# Altium schematic sheet charging sdc.SchDoc
size A; SheetNumber: 1; SheetTotal: 1
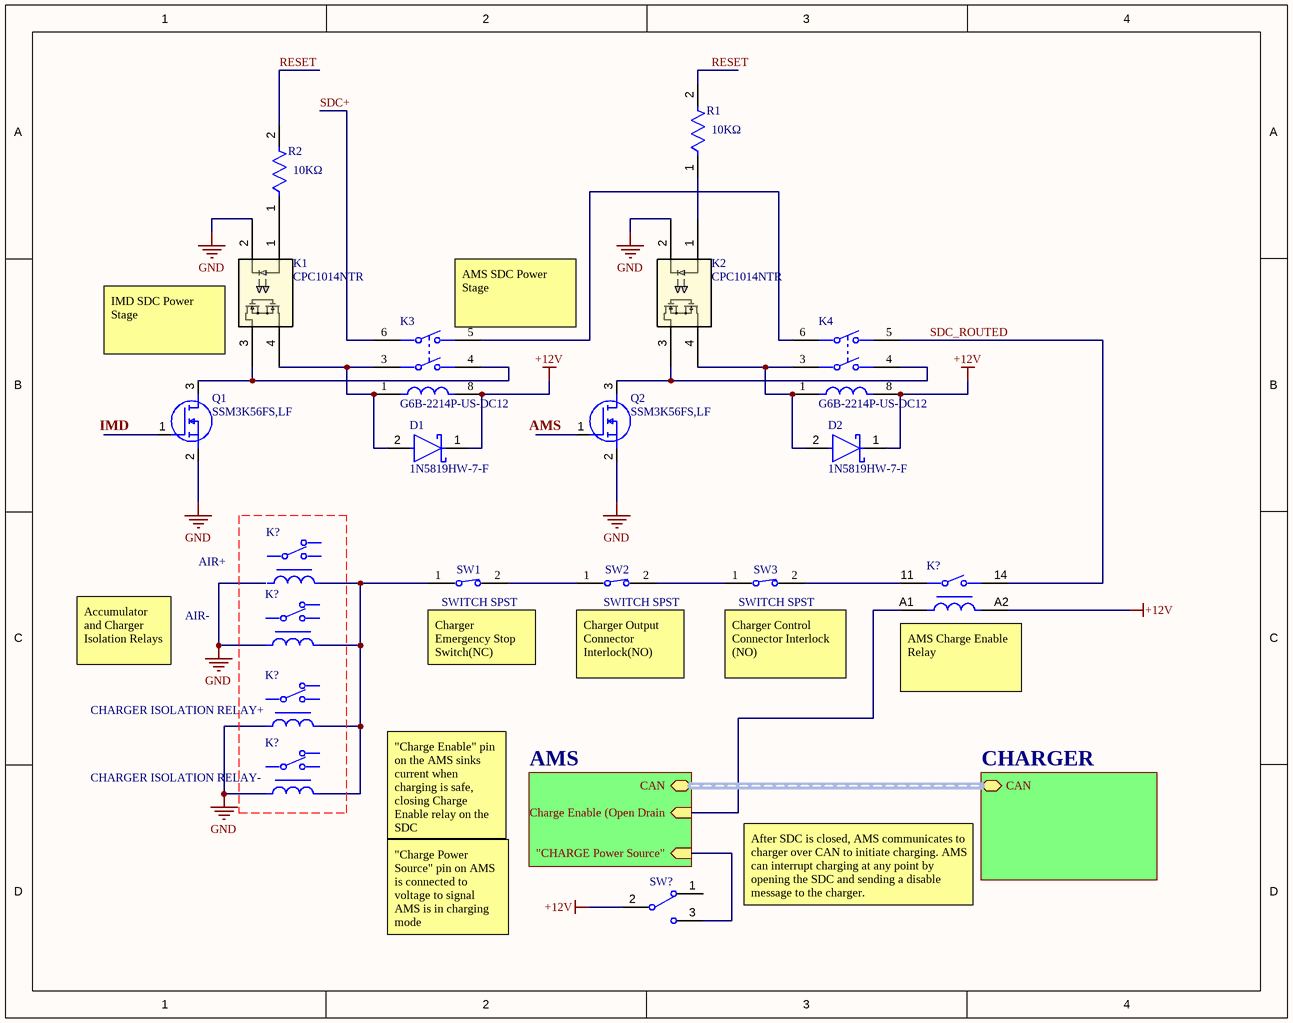
[diagram p0: charging sdc.SchDoc]

## Parts
(Parts that share a designator on the sheet are numbered #1, #2 ... from top to bottom, then left to right.)
D1  1N5819HW-7-F  [FP-SOD123-IPC_A]
D2  1N5819HW-7-F  [FP-SOD123-IPC_A]
K1  CPC1014NTR  [CPC1014N_IXY]
K2  CPC1014NTR  [CPC1014N_IXY]
K3  G6B-2214P-US-DC12  [FP-G6B-2214P-US-DC24-MFG]
K4  G6B-2214P-US-DC12  [FP-G6B-2214P-US-DC24-MFG]
K?#1  AIR+  [FP-T9AP5D52-12-MFG]
K?#2  1-1415899-6  [FP-1-1415899-6-MFG]  (value not drawn)
K?#3  AIR-  [FP-T9AP5D52-12-MFG]
K?#4  CHARGER ISOLATION RELAY+  [FP-T9AP5D52-12-MFG]
K?#5  CHARGER ISOLATION RELAY-  [FP-T9AP5D52-12-MFG]
Q1  SSM3K56FS,LF  [1SS423]
Q2  SSM3K56FS,LF  [1SS423]
R1  Resistance: 10KΩ  [FP-RP73P-2A-MFG]  (hidden comment: RP73PF2A10KBTDF)
R2  Resistance: 10KΩ  [FP-RP73P-2A-MFG]  (hidden comment: RP73PF2A10KBTDF)
SW1  SWITCH SPST  [FP-D3SH-B1L-MFG]
SW2  SWITCH SPST  [FP-D3SH-B1L-MFG]
SW3  SWITCH SPST  [FP-D3SH-B1L-MFG]
SW?  EG1218  [ESWI-EG1218_V]  (value not drawn)

## Sub-sheets
AMS = File Name: CAN (bidir), "CHARGE Power Source" (in), Charge Enable (Open Drain (in)
CHARGER = File Name: CAN (bidir)

## Nets
+12V: D1.1(C) D2.1(C) K3.8 K4.8 K?#2.A2 SW?.2(COM)
GND: K1.2 K2.2 Q1.2(S) Q2.2(S)
AMS: Q2.1(G)
IMD: Q1.1(G)
RESET: R1.2 R2.2
SDC+: K3.6
SDC_ROUTED: K4.5 K?#2.14
NetD1_2: D1.2(A) K1.4 K3.1 K3.3
NetD2_2: D2.2(A) K2.4 K4.1 K4.3
NetK1_1: K1.1 R2.1
NetK1_3: K1.3 K3.4 Q1.3(D)
NetK2_1: K2.1 R1.1
NetK2_3: K2.3 K4.4 Q2.3(D)
NetK3_5: K3.5 K4.6
NetK?#2_11: K?#2.11 SW3.2(NC)
NetK?#2_A1: K?#2.A1 ; sheet AMS/Charge Enable (Open Drain
NetSW1_2: SW1.2(NC) SW2.1(COM)
NetSW2_2: SW2.2(NC) SW3.1(COM)
NetSW?_3: SW?.3 ; sheet AMS/"CHARGE Power Source"

Not connected (* = marked no-connect by the designer): SW1 1(COM); SW? 1

## Buses and harness runs
harness sheet AMS/CAN = sheet CHARGER/CAN

## Notes on the sheet
- IMD SDC Power Stage
- (near K3) AMS SDC Power Stage
- Accumulator and Charger Isolation Relays
- (near SW1) Charger Emergency Stop Switch(NC)
- (near SW2) Charger Output Connector Interlock(NO)
- (near SW3) Charger Control Connector Interlock (NO)
- (near K?#2) AMS Charge Enable Relay
- "Charge Enable" pin on the AMS sinks current when charging is safe, closing Charge Enable relay on the SDC
- After SDC is closed, AMS communicates to charger over CAN to initiate charging. AMS can interrupt charging at any point by opening the SDC and sending a disable message to the charger.
- "Charge Power Source" pin on AMS is connected to voltage to signal AMS is in charging mode
- DWG. NO.
- REV.
- SHT.
- REVISION
- DESCRIPTION
- DATE
- APPROVED
- THIS DOCUMENT AND THE DATA DISCLOSED HEREIN OR HEREWITH IS THE PROPERTY OF ALTIUM LIMITED AND MAY BE FREELY DISTRIBUTED IN WHOLE. NO RIGHTS ARE RESERVED OR EXPRESS OR IMPLIED WARANTEE GIVEN.
- ENG:
- DSN:
- APPROVALS
- PROJECT
- DOCUMENT REVISION:
- DESIGN ITEM:
- CHK:
- BOM:
- REFERENCE DOCUMENTS
- PROJECT REVISION:
- TITLE
- FAB DWG:
- PCB DWG:
- ASSY DWG:
- SCALE:
- SIZE
- C
- CAGE CODE
- FILE NAME
- DWG NO.
- SHEET
- OF
- REV

## Library data of the parts
D1 D2 = CMP-0303-00003-3: DIODE SCHOTTKY 40V 1A SOD123; Forward Voltage: 450mV; Capacitance: 110pF; Max Forward Surge Current (Ifsm): 25A; Peak Reverse Current: 50uA; Polarity: Standard; Element Configuration: Single; Max Power Dissipation: 450mW; Min Operating Temperature: -65°C; Package Quantity: 3000; Contact Plating: Tin; Weight: 0.000353oz; Max Repetitive Reverse Voltage (Vrrm): 40V; Max Reverse Voltage (DC): 40V; Height: 1.25mm; Average Rectified Current: 1A; Width: 1.7mm; Case/Package: SOD-123-2; Lead Free: Lead Free; Max Operating Temperature: 125°C; Current Rating: 1A; Termination: SMD/SMT; Forward Current: 1A; Radiation Hardening: No; Number of Pins: 2; Length: 2.85mm; Voltage Rating (DC): 40V; REACH SVHC: No SVHC; Peak Non-Repetitive Surge Current: 25A; Packaging: Tape and Reel; Output Current: 1A
K1 K2 = CPC1014NTR: No Description Available; Mfr_Name: Littelfuse Inc; Copyright: Copyright (C) 2022 Ultra Librarian. All rights reserved.; Manufacturer_Part_Number: CPC1014NTR; Digi-Key_Part_Number_1: CLA314TR-ND; Digi-Key_Part_Number_2: CLA314CT-ND; Digi-Key_Part_Number_3: CLA314DKR-ND; RefDes: RefDes; Type: DEV
K3 K4 = CMP-08822-000243-1: RELAY GEN PURPOSE DPST 5A 24V; Voltage Rating (DC): 125V; Release Time: 10ms; Relay Type: General Purpose; Coil Current: 8.3mA; Coil Power: 300mW; Max Voltage Rating (AC): 380V; Approvals: UL; Power Consumption: 200mW; Coil Type: Non-Latching; Coil Resistance: 2.88kR; Number of Pins: 6; Width: 10mm; Radiation Hardening: No; Contact Current Rating: 5A; Length: 20mm; Min Operating Temperature: -25°C; Operate Time: 10ms; Max Voltage Rating (DC): 125V; Depth: 11mm; Packaging: Bulk; Lead Free: Lead Free; Contact Material: Silver; Case/Package: DIP; Throw Configuration: DPST; Mount: Through Hole; Max Operating Temperature: 70°C; Coil Voltage (DC): 24V; Max Current Rating: 5A; Height: 10mm; Package Quantity: 100; Weight: 0.141096oz; Voltage Rating (AC): 380V; Current Rating: 5A; Series: G6B; Termination: PC Pin
K?#1 K?#3-K?#5 = CMP-03395-000322-1: RELAY GEN PURPOSE SPDT 20A 12V; Coil Resistance: 144R; Contact Voltage Rating (AC): 277V; Release Time: 15ms; Coil Power: 1W; Coil Current: 83mA; Approvals: UL; Max Voltage Rating (DC): 28V; Current Rating: 30A; Relay Type: General Purpose; Coil Type: Non-Latching; Series: T9A; Mount: Panel; Min Operating Temperature: -55°C; ELV: Non-Compliant; Depth: 27.43mm; Width: 27.4mm; Radiation Hardening: No; Throw Configuration: SPDT; Weight: 33g; Coil Voltage (DC): 12V; Length: 32.5mm; Height: 1.098inch; Number of Pins: 5; Operate Time: 15ms; Contact Material: Silver; Power Consumption: 1W; Lead Free: Lead Free; Voltage Rating (AC): 277V; Termination: Quick Connect; Max Operating Temperature: 85°C; RoHS Compliant: Yes; Package Quantity: 50; Packaging: Bulk; Max Voltage Rating (AC): 277V; Contact Current Rating: 20A
K?#2 = CMP-03395-000032-1: RELAY GEN PURPOSE SPST 16A 12V; Manufacturer: TE Connectivity; Throw Configuration: SPST-NO; Coil Type: Non-Latching; Coil Power: 400mW; Number Of Contacts: 1; Coil Resistance: 360Ω; Height: 16mm; Device Class L1: Electromechanical; ComponentLink2URL: https://www.te.com/commerce/DocumentDelivery/DDEController?Action=showdoc&DocId=Data+Sheet%7FRZ%7F0918%7Fpdf%7FEnglish%7FENG_DS_RZ_0918.pdf%7F1-1415899-6; Current Rating: 16A; RoHS: TRUE; Automotive: No; Lead Free: Yes; Manufacturer Part Number: 1-1415899-6; Digikey Description: RELAY GEN PURPOSE SPST 16A 12V; ComponentLink2Description: Datasheet; Octopart: https://octopart.com/1-1415899-6-te+connectivity-46507462; Package: 1-1415899-6; Coil Voltage: 12V; Device Class L2: Relays; Category: Relay; Ambient Temperature Range Low: -40°C; Device Class L3: Power Relays; Ambient Temperature Range High: +85°C
Q1 Q2 = SSM3K56FS,LF: MOSFET (N-Channel); Manufacturer_Name: Toshiba; Datasheet Link: http://toshiba.semicon-storage.com/info/docget.jsp?did=13419&prodName=SSM3K56FS; Height: 0mm; Manufacturer_Part_Number: SSM3K56FS,LF; Mouser Part Number: 757-SSM3K56FSLF; Mouser Price/Stock: https://www.mouser.co.uk/ProductDetail/Toshiba/SSM3K56FSLF?qs=PiFplXvYe5XjAd54EjZm0w%3D%3D; Arrow Part Number: SSM3K56FS,LF; Arrow Price/Stock: https://www.arrow.com/en/products/ssm3k56fslf/toshiba?region=nac
R1 R2 = CMP-03211-008023-1: RP73P 0805 10KΩ 0.25W 25ppm/°C 0.10% 150V; Manufacturer: TE Connectivity; Tolerance: 0.001; Package: RP73P-2A; ComponentLink2URL: https://www.te.com/commerce/DocumentDelivery/DDEController?Action=srchrtrv&DocNm=1773272&DocType=DS&DocLang=English; Series: RP73P; Manufacturer Part Number: RP73PF2A10KBTDF; ComponentLink2Description: Datasheet; RoHS: TRUE; Category: Res; Device Class L3: Chip SMD Resistors; Device Class L2: Resistors; Device Class L1: Passive Components; Temperature: -55°C to +155°C; Temperature Coefficient: 25ppm/°C; Temperature Range Low: -55°C; Power Rating: 0.25W; Octopart: https://octopart.com/2176093-5-te+connectivity-46441071; Ipc Land Pattern Name: RESC200125X55; Automotive: No; Composition: Thin Film; Lead Free: Yes; Value: 10KΩ; Height: 0.65mm; Voltage Rating: 150V; Temperature Range High: +155°C
SW1 = CMP-08833-000162-1: SWITCH DETECTOR SPST-N; Contact Current Rating: 1mA; Actuator Type: Toggle; Connector Type: SMD/SMT; Contact Resistance: 3R; Body Length: 3mm; Body Height: 0.9mm; Operating Force: 0.3N; Operating Position: 0.197inch; Switch Function: On-Mom; Max Voltage Rating (DC): 5V; Body Depth: 3.1mm; Number of Terminals/Pins: 2; Electrical Life: 100000Cycles; Mechanical Life: 150000Cycles; Voltage Rating (DC): 30V; Actuator Length: 2.3mm; Width: 3mm; Number of Pins: 2; Throw Configuration: SPST; Height: 0.9mm; Orientation: Right Angle; Package Quantity: 1000; Max Operating Temperature: 85°C; Mount: Surface Mount; Min Operating Temperature: -25°C; Current Rating: 1mA; Series: D3SH; Packaging: Tape and Reel; Termination: SMD/SMT; Case/Package: SMD/SMT
SW2 SW3 = CMP-08833-000162-1: Contact Current Rating: 1mA; Actuator Type: Toggle; Connector Type: SMD/SMT; Contact Resistance: 3R; Body Length: 3mm; Body Height: 0.9mm; Operating Force: 0.3N; Operating Position: 0.197inch; Switch Function: On-Mom; Max Voltage Rating (DC): 5V; Body Depth: 3.1mm; Number of Terminals/Pins: 2; Electrical Life: 100000Cycles; Mechanical Life: 150000Cycles; Voltage Rating (DC): 30V; Actuator Length: 2.3mm; Width: 3mm; Number of Pins: 2; Throw Configuration: SPST; Height: 0.9mm; Orientation: Right Angle; Package Quantity: 1000; Max Operating Temperature: 85°C; Mount: Surface Mount; Min Operating Temperature: -25°C; Current Rating: 1mA; Series: D3SH; Packaging: Tape and Reel; Termination: SMD/SMT; Case/Package: SMD/SMT
SW? = CMP-011-00006-2: Slide Switch, SPDT, 500 V, -20 to 70 degC, 3-Pin THD, RoHS, Bulk; Manufacturer: E-Switch; Voltage Rating (DC): 30V; Current Rating: 200mA; Operating Force: 250gf; Package Quantity: 1000; Contact Plating: Silver; Max Operating Temperature: 70°C; Min Operating Temperature: -20°C; Contact Material: Copper; Datasheet URL: https://www.e-switch.com/system/asset/product_line/data_sheet/119/EG.pdf; Contact Finish: Silver; Case/Package: EG1218; Voltage Rating (AC): 30V; Datasheet Version: Oct-15; Package Description: 3-Pin Through Hole Device, Body 11.6 x 4 mm, Pitch 2.5 mm; RoHS Compliant: True; Package Reference: EG1218; Manufacturer URL: http://www.e-switch.ch/en/; Throw Configuration: SPDT; Contact Current Rating: 200mA; Mounting Technology: TH; Packaging: Bulk; Pins: 3